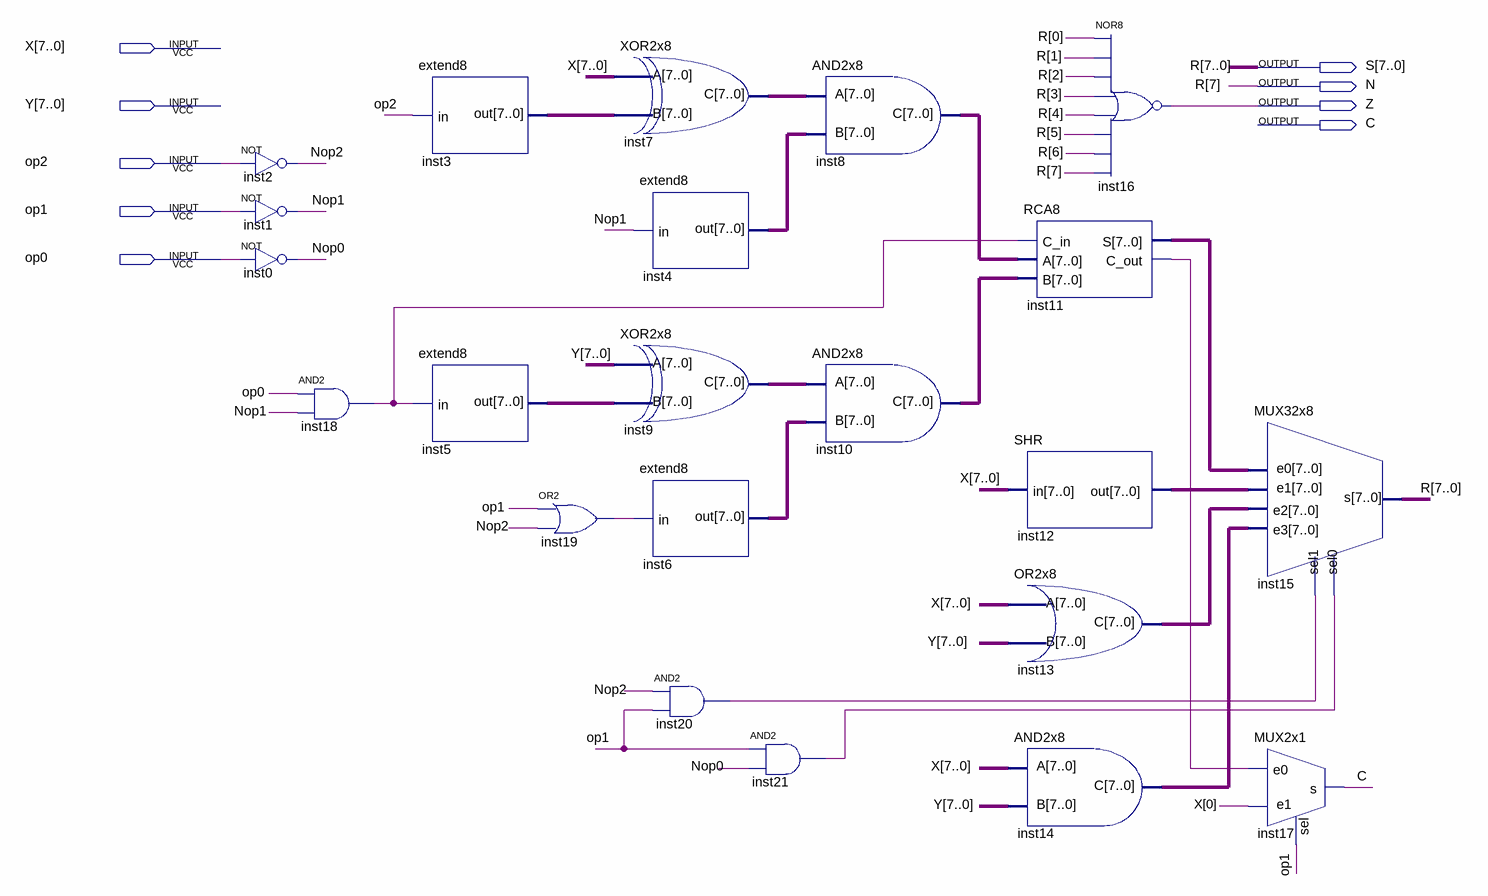
[diagram p0: schematic sheet]
// Quartus schematic ALU.bdf as structural Verilog: 22 symbols, 9 pins
module ALU (
  input  [7:0] X,
  input  [7:0] Y,
  input  op2,
  input  op1,
  input  op0,
  output [7:0] S,
  output N,
  output Z,
  output C
);

  wire inst11_c_out, inst18_out, inst19_out, inst20_out, inst21_out, Nop0, Nop1, Nop2;
  wire [7:0] inst3_out, inst4_out, inst5_out, inst6_out, inst7_c, inst8_c, inst9_c, inst10_c, inst11_s,
       inst12_out, inst13_c, inst14_c;

  not inst2 (Nop2, op2);
  not inst1 (Nop1, op1);
  not inst0 (Nop0, op0);
  and inst18 (inst18_out, op0, Nop1);
  extend8 inst3 (.in(op2), .out(inst3_out));
  extend8 inst5 (.in(inst18_out), .out(inst5_out));
  or inst19 (inst19_out, op1, Nop2);
  XOR2x8 inst7 (.A(X), .B(inst3_out), .C(inst7_c));
  extend8 inst4 (.in(Nop1), .out(inst4_out));
  XOR2x8 inst9 (.A(Y), .B(inst5_out), .C(inst9_c));
  extend8 inst6 (.in(inst19_out), .out(inst6_out));
  and inst20 (inst20_out, Nop2, op1);
  AND2x8 inst8 (.A(inst7_c), .B(inst4_out), .C(inst8_c));
  AND2x8 inst10 (.A(inst9_c), .B(inst6_out), .C(inst10_c));
  and inst21 (inst21_out, op1, Nop0);
  RCA8 inst11 (.C_in(inst18_out), .A(inst8_c), .B(inst10_c), .S(inst11_s), .C_out(inst11_c_out));
  SHR inst12 (.in(X), .out(inst12_out));
  OR2x8 inst13 (.A(X), .B(Y), .C(inst13_c));
  AND2x8 inst14 (.A(X), .B(Y), .C(inst14_c));
  nor inst16 (Z, S[0], S[1], S[2], S[3], S[4], S[5], S[6], N);
  MUX32x8 inst15 (
    .e0(inst11_s), .e1(inst12_out), .e2(inst13_c), .e3(inst14_c), .sel0(inst21_out), .sel1(inst20_out),
    .s({N, S[6:0]}));
  MUX2x1 inst17 (.e0(inst11_c_out), .e1(X[0]), .sel(op1), .s(C));

  assign S[7] = N;

  // Other names for the same wires on the sheet: R[7:0] = {N, S[6:0]}
endmodule
